# EAGLE design Pill Minder shield (EAGLE 6.5.0)
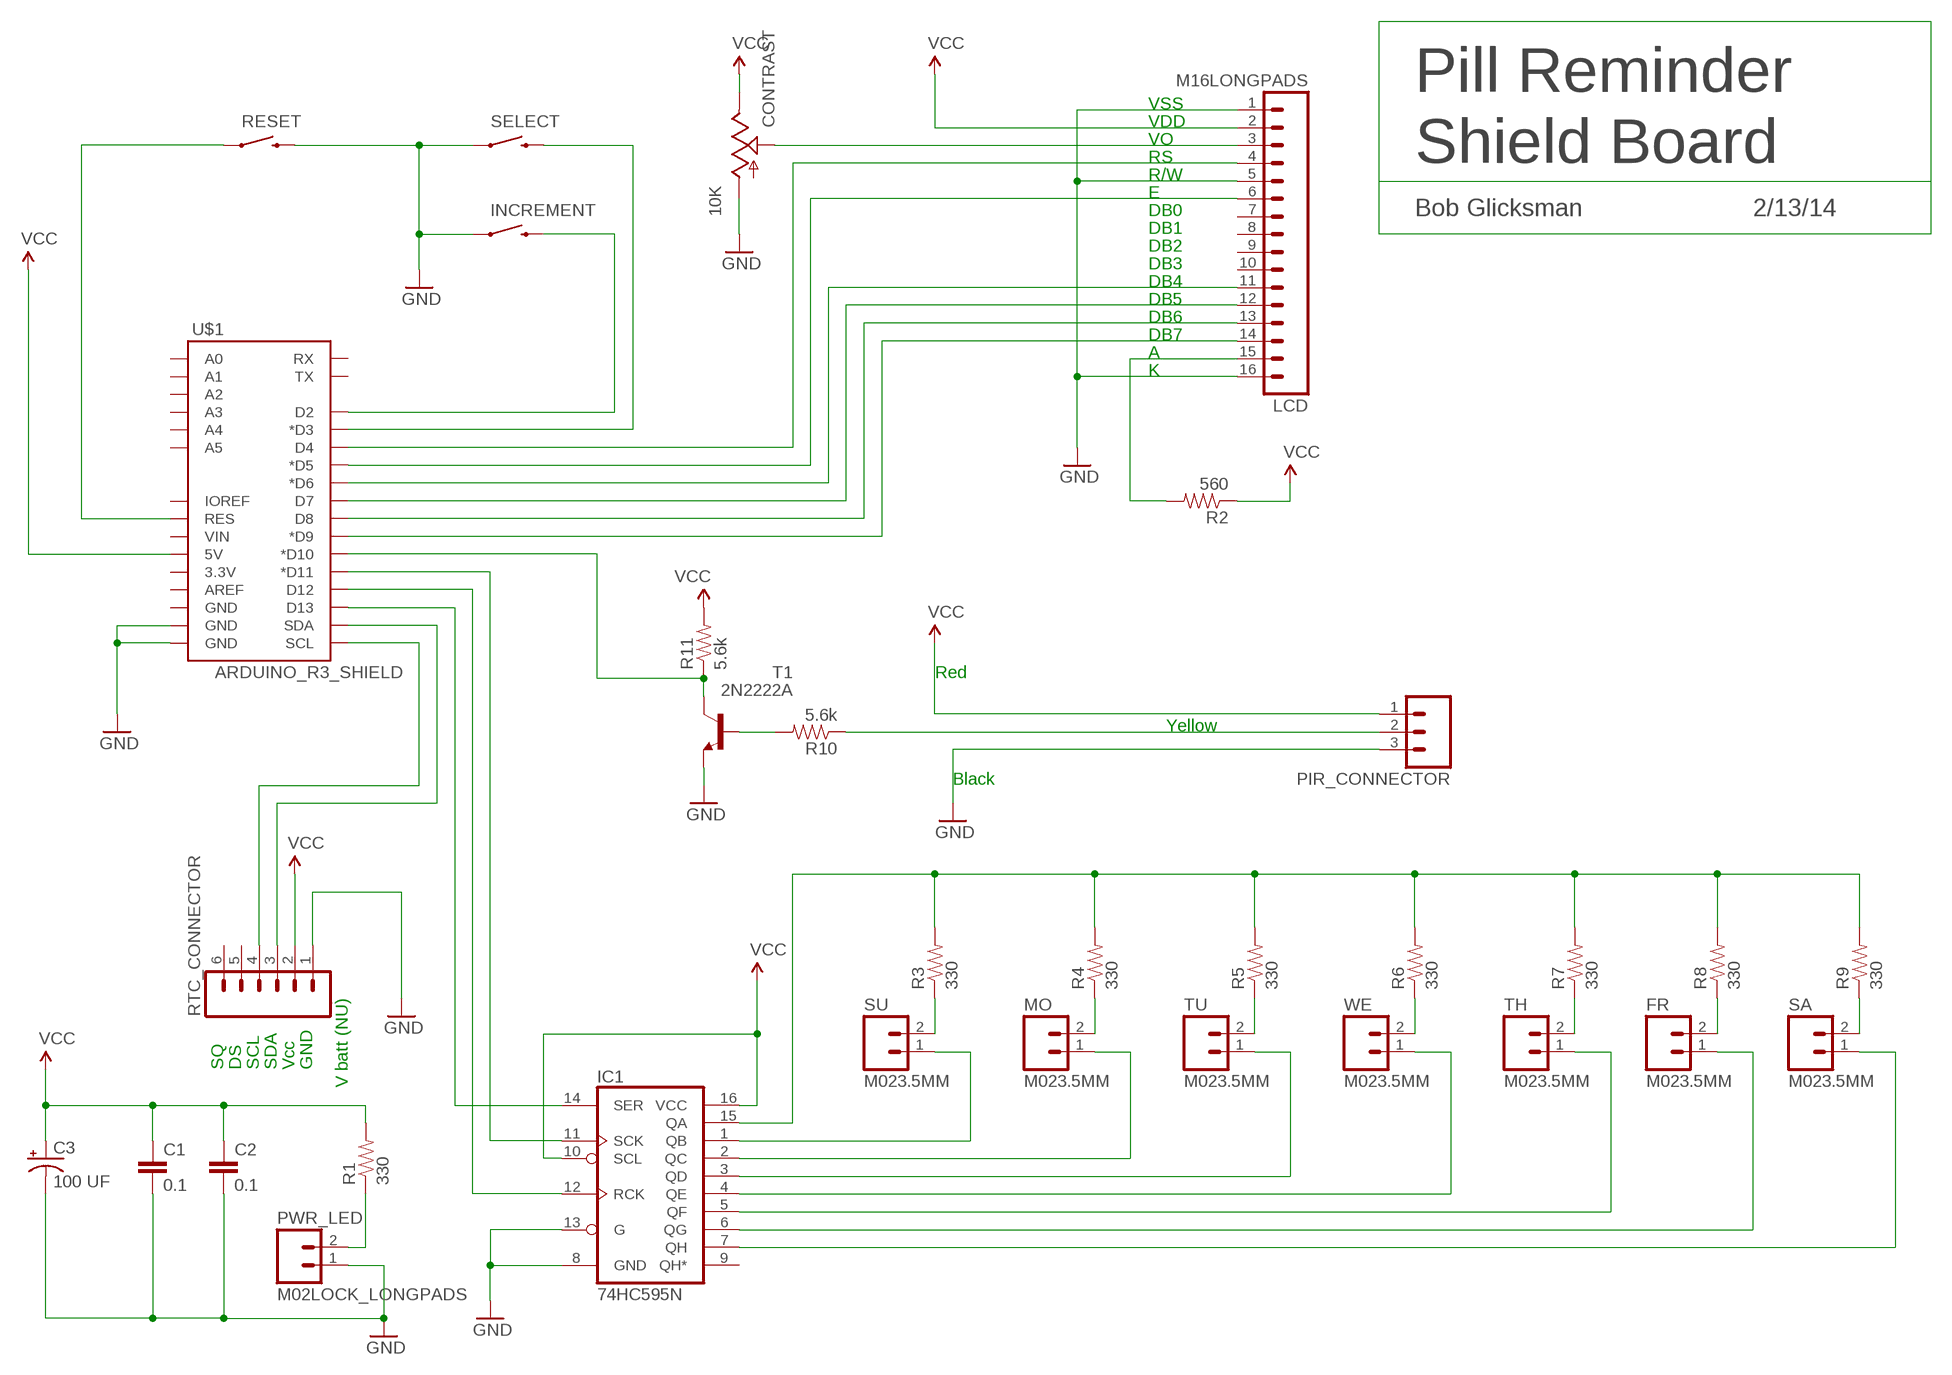
[diagram p0: schematic, sheet 1]

## Parts
C1  0.1  CAPPTH2  [CAP-PTH-SMALL2]
C2  0.1  CAPPTH2  [CAP-PTH-SMALL2]
C3  100 UF  CAP_POLPTH1  [CPOL-RADIAL-100UF-25V]
CONTRAST  10K  POTTRIM  [TRIM_POT]
FR  M023.5MM  [SCREWTERMINAL-3.5MM-2]
IC1  74HC595N  74LS595N  [DIL16]
INCREMENT  SWITCH-MOMENTARY-2PTH  [TACTILE-PTH]
LCD  M16LONGPADS  [1X16_LONGPADS]
MO  M023.5MM  [SCREWTERMINAL-3.5MM-2]
PIR_CONNECTOR  M03LONGPADS  [1X03_LONGPADS]
PWR_LED  M02LOCK_LONGPADS  [1X02_LOCK_LONGPADS]
R1  330  RESISTORPTH-1/4W  [AXIAL-0.4]
R2  560  RESISTORPTH-1/4W  [AXIAL-0.4]
R3  330  RESISTORPTH-1/4W  [AXIAL-0.4]
R4  330  RESISTORPTH-1/4W  [AXIAL-0.4]
R5  330  RESISTORPTH-1/4W  [AXIAL-0.4]
R6  330  RESISTORPTH-1/4W  [AXIAL-0.4]
R7  330  RESISTORPTH-1/4W  [AXIAL-0.4]
R8  330  RESISTORPTH-1/4W  [AXIAL-0.4]
R9  330  RESISTORPTH-1/4W  [AXIAL-0.4]
R10  5.6k  RESISTORPTH-1/4W  [AXIAL-0.4]
R11  5.6k  RESISTORPTH-1/4W  [AXIAL-0.4]
RESET  SWITCH-MOMENTARY-2PTH  [TACTILE-PTH]
RTC_CONNECTOR  M06LONGPADS  [1X06_LONGPADS]
SA  M023.5MM  [SCREWTERMINAL-3.5MM-2]
SELECT  SWITCH-MOMENTARY-2PTH  [TACTILE-PTH]
SU  M023.5MM  [SCREWTERMINAL-3.5MM-2]
T1  2N2222A  -NPN-TO92-EBC  [TO92-EBC]
TH  M023.5MM  [SCREWTERMINAL-3.5MM-2]
TU  M023.5MM  [SCREWTERMINAL-3.5MM-2]
U$1  ARDUINO_R3_SHIELD  [UNO_R3_SHIELD]
WE  M023.5MM  [SCREWTERMINAL-3.5MM-2]

## Nets
GND: C1.2 C2.2 C3.2(-) CONTRAST.3(A) IC1.8(GND) IC1.13(G) INCREMENT.1 LCD.1 LCD.5 LCD.16 PIR_CONNECTOR.3 PWR_LED.1 RESET.3 RTC_CONNECTOR.1 SELECT.1 T1.E U$1.GND@0(GND) U$1.GND@1(GND)
N$1: RESET.1 U$1.RES
N$2: IC1.7(QH) SA.1
N$3: IC1.1(QB) SU.1
N$4: R10.P$2 T1.B
N$5: IC1.2(QC) MO.1
N$6: IC1.3(QD) TU.1
N$7: IC1.4(QE) WE.1
N$8: IC1.5(QF) TH.1
N$9: FR.1 IC1.6(QG)
N$10: CONTRAST.1(S) LCD.3
N$11: SELECT.3 U$1.D3(*D3)
N$12: INCREMENT.3 U$1.D2
N$13: IC1.14(SER) U$1.D13
N$14: IC1.12(RCK) U$1.D12
N$15: IC1.11(SCK) U$1.D11(*D11)
N$16: RTC_CONNECTOR.4 U$1.SCL
N$17: RTC_CONNECTOR.3 U$1.SDA
N$18: LCD.4 U$1.D4
N$19: LCD.6 U$1.D5(*D5)
N$20: LCD.11 U$1.D6(*D6)
N$21: LCD.12 U$1.D7
N$22: LCD.13 U$1.D8
N$23: LCD.14 U$1.D9(*D9)
N$24: LCD.15 R2.P$2
N$26: R11.P$1 T1.C U$1.D10(*D10)
N$27: PWR_LED.2 R1.P$1
N$29: PIR_CONNECTOR.2 R10.P$1
N$30: R3.P$1 SU.2
N$31: MO.2 R4.P$1
N$32: R5.P$1 TU.2
N$33: R6.P$1 WE.2
N$34: R7.P$1 TH.2
N$35: IC1.15(QA) R3.P$2 R4.P$2 R5.P$2 R6.P$2 R7.P$2 R8.P$2 R9.P$2
N$36: R9.P$1 SA.2
N$37: FR.2 R8.P$1
VCC: C1.1 C2.1 C3.1(+) CONTRAST.2(E) IC1.10(SCL) IC1.16(VCC) LCD.2 PIR_CONNECTOR.1 R1.P$2 R2.P$1 R11.P$2 RTC_CONNECTOR.2 U$1.5V
Unconnected: IC1.9(QH*) LCD.7 LCD.8 LCD.9 LCD.10 RTC_CONNECTOR.5 RTC_CONNECTOR.6 U$1.3.3V U$1.A0 U$1.A1 U$1.A2 U$1.A3 U$1.A4 U$1.A5 U$1.AREF U$1.GND@2(GND) U$1.IOREF U$1.RX U$1.TX U$1.VIN

## Notes on the sheet
- Pill Reminder
- VSS
- VDD
- VO
- RS | Shield Board
- R/W
- E
- DB0 | Bob Glicksman | 2/13/14
- DB1
- DB2
- DB3
- DB4
- DB5
- DB6
- DB7
- A
- K
- Red
- Yellow
- Black
- SQ | DS | SCL | SDA | Vcc | GND
- V batt (NU)

## Library data of the parts
C1 C2 = SparkFun-Capacitors:CAP: Capacitor Standard 0603 ceramic capacitor, and 0.1" leaded capacitor.
C3 = SparkFun-Capacitors:CAP_POL: Capacitor Polarized These are standard SMD and PTH capacitors. Normally 10uF, 47uF, and 100uF in electrolytic and tantalum varieties. Always verify the external diameter of the through hole cap, it varies with capacity, voltage, and manufacturer. The EIA devices should be standard.
CONTRAST = SparkFun-Electromechanical:POT
FR MO PWR_LED SA SU TH TU WE = SparkFun-Connectors:M02: Standard 2-pin 0.1" header. Use with - straight break away headers ( PRT-00116) - right angle break away headers (PRT-00553) - swiss pins (PRT-00743) - machine pins (PRT-00117) - female headers (PRT-00115) Molex polarized connector foot print use with: PRT-08233 with associated crimp pins and housings. 2.54_SCREWTERM for use with PRT-10571. 3.5mm Screw Terminal footprints for PRT-08084 5mm Screw Terminal footprints for use with PRT-08433
IC1 = SparkFun-DigitalIC:74*595: 8-bit SHIFT REGISTER, output latch
INCREMENT RESET SELECT = SparkFun-Electromechanical:SWITCH-MOMENTARY-2: Various NO switches- pushbuttons, reed, etc
LCD = SparkFun-Connectors:M16: 1x16 .1" header
PIR_CONNECTOR = SparkFun-Connectors:M03: Header 3 Standard 3-pin 0.1" header. Use with straight break away headers (SKU : PRT-00116), right angle break away headers (PRT-00553), swiss pins (PRT-00743), machine pins (PRT-00117), and female headers (PRT-00115). Molex polarized connector foot print use with SKU : PRT-08232 with associated crimp pins and housings.
R1-R11 = SparkFun-Resistors:RESISTOR: Resistor Basic schematic elements and footprints for 0603, 1206, and PTH resistors.
RTC_CONNECTOR = SparkFun-Connectors:M06: Header 6 Standard 6-pin 0.1" header. Use with straight break away headers (SKU : PRT-00116), right angle break away headers (PRT-00553), swiss pins (PRT-00743), machine pins (PRT-00117), and female headers (PRT-00115). Molex polarized connector foot print use with SKU : PRT-08094 with associated crimp pins and housings. NOTES ON THE VARIANTS LOCK and LOCK_LONGPADS... This footprint was designed to help hold the alignment of a through-hole component (i.e. 6-pin header) while soldering it into place. You may notice that each hole has been shifted either up or down by 0.005 of an inch from it's more standard position (which is a perfectly straight line). This slight alteration caused the pins (the squares in the middle) to touch the edges of the holes. Because they are alternating, it causes a "brace" to hold the component in place. 0.005 has proven to be the perfect amount of "off-center" position when using our standard breakaway headers. Although looks a little odd when you look at the bare footprint, once you have a header in there, the alteration is very hard to notice. Also,if you push a header all the way into place, it is covered up entirely on the bottom side. This idea of altering the position of holes to aid alignment will be further integrated into the Sparkfun Library for other footprints. It can help hold any component with 3 or more connection pins.
T1 = transistor:*-NPN-: NPN Transistror BF959 corrected 2008.03.06
U$1 = SparkFun-Boards:ARDUINO_R3_SHIELD: Shield form compatible with the Arduino Uno R3.

## Board
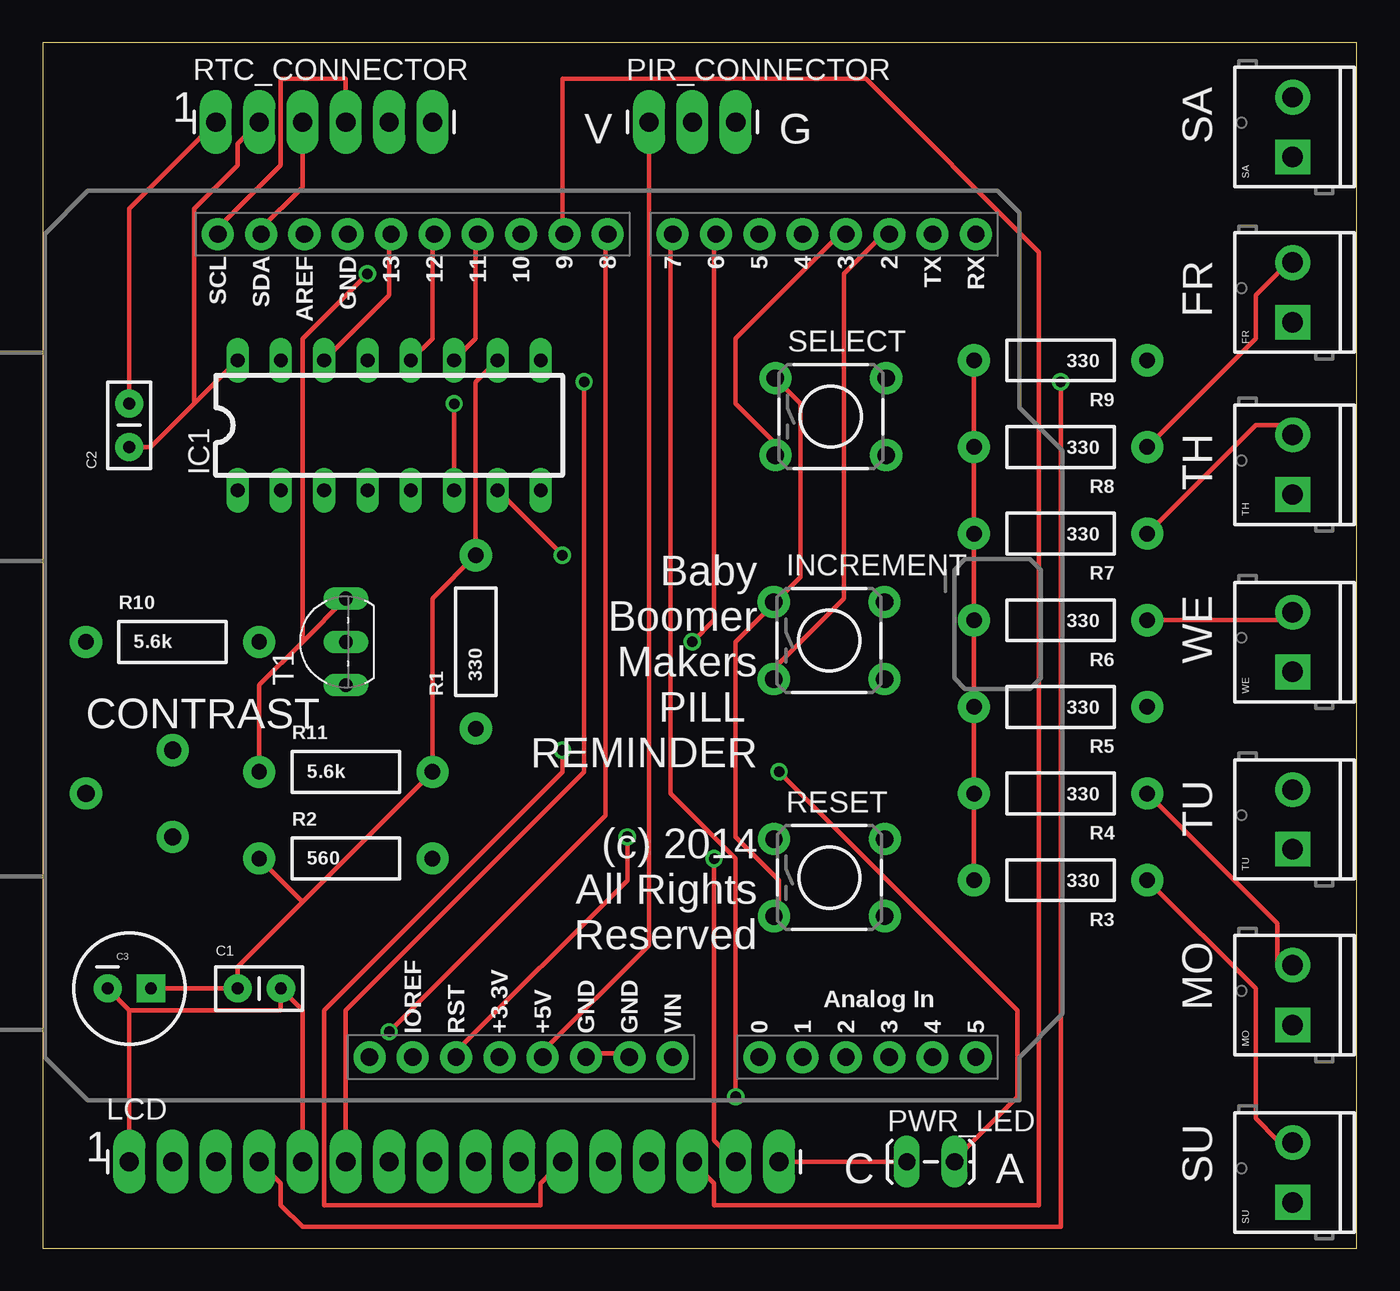
[diagram p1: board, top side]
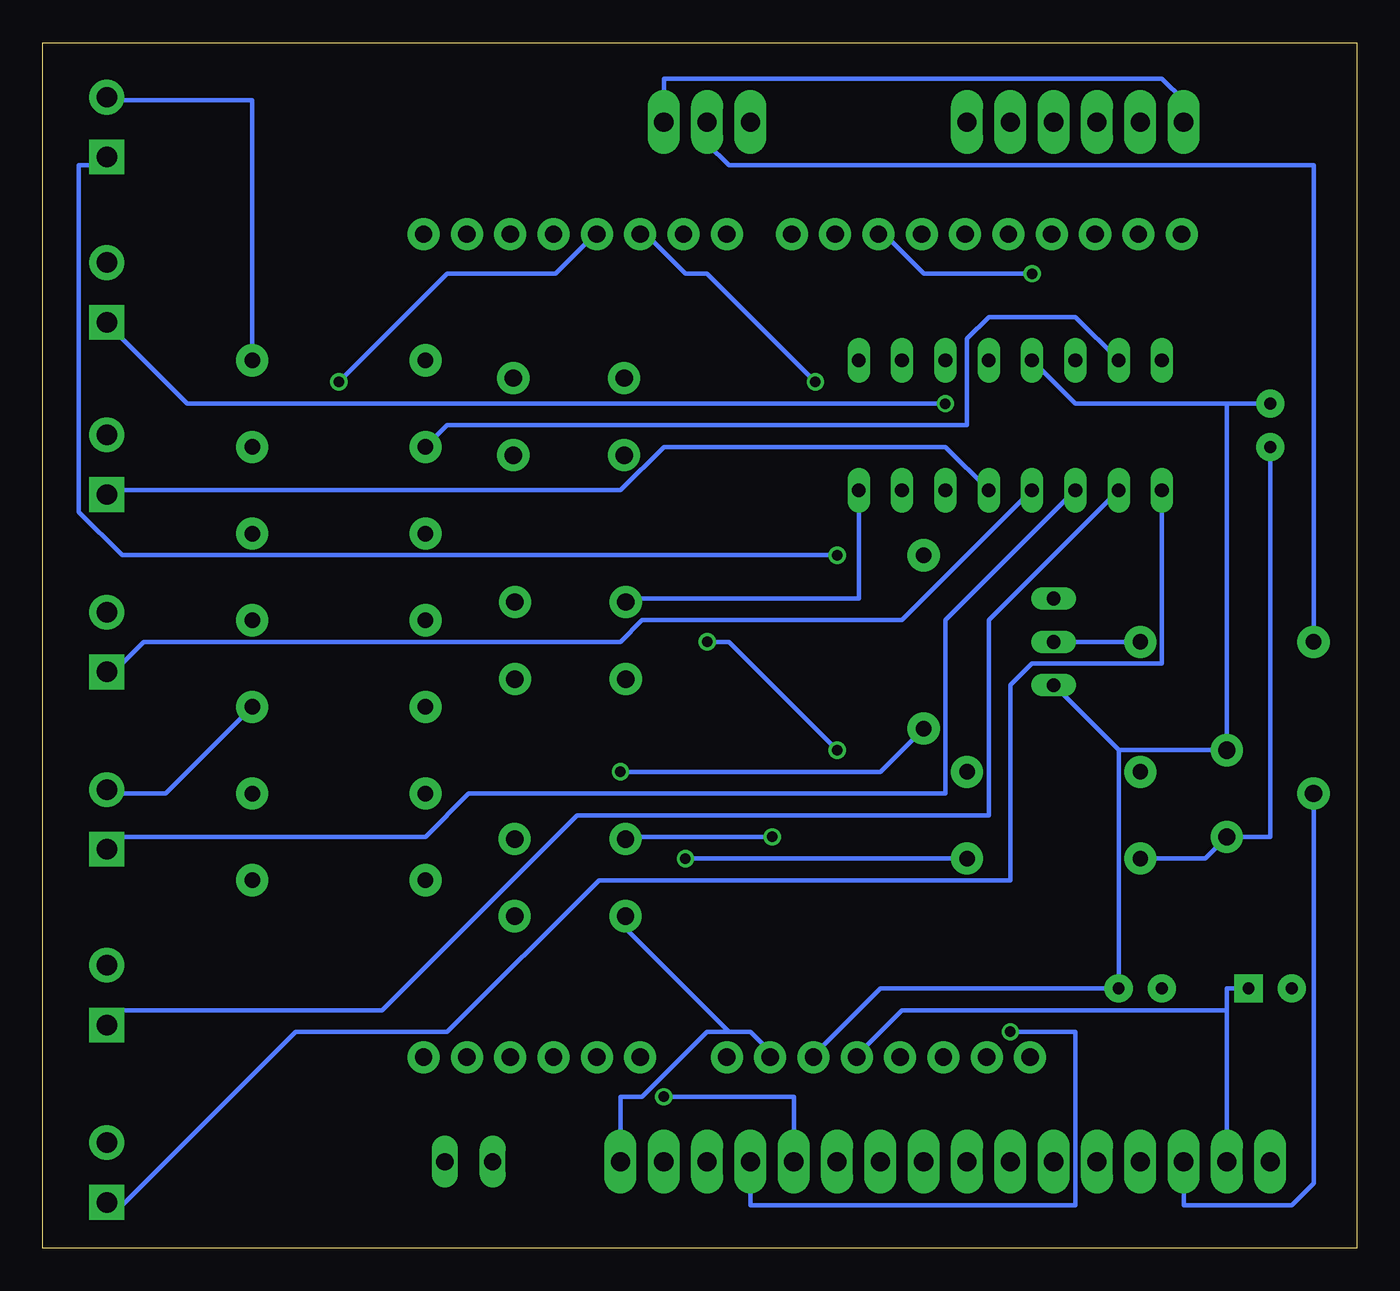
[diagram p2: board, bottom side, seen from below]

Size 77.06 x 70.7 mm. Coordinates in mm from the lower left corner, seen from the top.
Outline: 0,0 77.06,0 77.06,70.7 0,70.7 0,0
Copper layers (1*16): Top 0.035mm / dielectric 1.5mm / Bottom 0.035mm
Design rules "default": minimum track width 10mil, minimum drill 24mil, track to track 8mil, track to pad 8mil, pad to pad 8mil, via to via 8mil, smd to smd 8mil, copper to edge 40mil, drill to drill 8mil, minimum pad ring 10mil, minimum via ring 8mil, stop-mask expansion 4mil, vias tented up to drill 0mil, thermal gap 10mil

### Footprints (pad centres in the part's own frame; a part is rotated, then mirrored left to right if it is on the bottom)
CAP-PTH-SMALL2 = drill 0.7 pad 1.651: 1 0,0; 2 2.54,0
CPOL-RADIAL-100UF-25V = drill 0.7 pad 1.651 square: 1 1.27,0 | drill 0.7 pad 1.651: 2 -1.27,0
TRIM_POT = drill 1 pad 1.88: 1 5.08,0; 2 0,2.54; 3 0,-2.54
SCREWTERMINAL-3.5MM-2 = drill 1.2 pad 2.032 square: 1 0,0 | drill 1.2 pad 2.032: 2 3.5,0
DIL16 = drill 0.813 long: 1 -8.89,-3.81; 2 -6.35,-3.81; 3 -3.81,-3.81; 4 -1.27,-3.81; 5 1.27,-3.81; 6 3.81,-3.81; 7 6.35,-3.81; 8 8.89,-3.81; 9 8.89,3.81; 10 6.35,3.81; 11 3.81,3.81; 12 1.27,3.81; 13 -1.27,3.81; 14 -3.81,3.81; 15 -6.35,3.81; 16 -8.89,3.81
TACTILE-PTH = drill 1.016 pad 1.88: 1 -3.251,2.261; 2 3.251,2.261; 3 -3.251,-2.261; 4 3.251,-2.261
1X16_LONGPADS = drill 1.118 pad 1.88 long: 1 0,0; 2 2.54,0; 3 5.08,0; 4 7.62,0; 5 10.16,0; 6 12.7,0; 7 15.24,0; 8 17.78,0; 9 20.32,0; 10 22.86,0; 11 25.4,0; 12 27.94,0; 13 30.48,0; 14 33.02,0; 15 35.56,0; 16 38.1,0
1X03_LONGPADS = drill 1.118 pad 1.88 long: 1 0,0; 2 2.54,0; 3 5.08,0
1X02_LOCK_LONGPADS = drill 1.016 long: 1 -0.127,0; 2 2.667,0
AXIAL-0.4 = drill 0.9 pad 1.88: P$1 -5.08,0; P$2 5.08,0
1X06_LONGPADS = drill 1.118 pad 1.88 long: 1 0,0; 2 2.54,0; 3 5.08,0; 4 7.62,0; 5 10.16,0; 6 12.7,0
TO92-EBC = drill 0.813 long: B 0,-1.27; C 2.54,-1.27; E -2.54,-1.27
UNO_R3_SHIELD = drill 1.016 pad 1.88: 3.3V 50.8,26.67; 5V 50.8,29.21; A0 50.8,41.91; A1 50.8,44.45; A2 50.8,46.99; A3 50.8,49.53; A4 50.8,52.07; A5 50.8,54.61; AREF 2.54,15.24; D2 2.54,49.53; D3 2.54,46.99; D4 2.54,44.45; D5 2.54,41.91; D6 2.54,39.37; D7 2.54,36.83; D8 2.54,33.02; D9 2.54,30.48; D10 2.54,27.94; D11 2.54,25.4; D12 2.54,22.86; D13 2.54,20.32; GND@0 50.8,31.75; GND@1 50.8,34.29; GND@2 2.54,17.78; IOREF 50.8,21.59; NC 50.8,19.05; RES 50.8,24.13; RX 2.54,54.61; SCL 2.54,10.16; SDA 2.54,12.7; TX 2.54,52.07; VIN 50.8,36.83

### Placement (x,y rotation side)
C1  11.43,15.24 0 top
C2  5.08,46.99 90 top
C3  5.08,15.24 0 top
CONTRAST  7.62,26.67 180 top
FR  73.3,54.3 90 top
IC1  20.32,48.26 0 top
INCREMENT  46.12,35.64 0 top
LCD  5.08,5.08 0 top
MO  73.3,13.1 90 top
PIR_CONNECTOR  35.56,66.04 0 top
PWR_LED  50.8,5.08 0 top
R1  25.4,35.56 90 top
R2  17.78,22.86 0 top
R3  59.69,21.59 180 top
R4  59.69,26.67 180 top
R5  59.69,31.75 180 top
R6  59.69,36.83 180 top
R7  59.69,41.91 180 top
R8  59.69,46.99 180 top
R9  59.69,52.07 180 top
R10  7.62,35.56 0 top
R11  17.78,27.94 0 top
RESET  46.13,21.74 0 top
RTC_CONNECTOR  10.16,66.04 0 top
SA  73.3,64 90 top
SELECT  46.21,48.77 0 top
SU  73.3,2.7 90 top
T1  16.51,35.56 90 top
TH  73.3,44.2 90 top
TU  73.3,23.4 90 top
U$1  0.11,62.01 270 top
WE  73.3,33.8 90 top

### Tracks (layer width: path | path; a pad name or v marks a point on that pad's centre or on a via)
GND
  Top 0.254: 43.18,38.1 44.45,39.37 44.45,49.53 43.18,50.8 SELECT.1 | U$1.GND@0 31.75,11.43 34.29,11.43 U$1.GND@1 | 43.18,38.1 40.64,35.56 40.64,24.13 43.18,21.59 43.18,20.32 RESET.3 | 43.18,38.1 INCREMENT.1 | 5.08,13.97 C3.2 | LCD.1 5.08,13.97 | LCD.5 15.24,13.97 C1.2 13.97,13.97 5.08,13.97 | RTC_CONNECTOR.1 5.08,60.96 C2.2 | LCD.16 PWR_LED.1 50.8,5.08
  Bottom 0.254: IC1.8 29.21,38.1 43.18,38.1 INCREMENT.1 | 36.83,12.7 43.18,19.05 RESET.3 | 36.83,12.7 35.56,12.7 34.29,11.43 U$1.GND@1 | LCD.16 43.18,8.89 41.91,8.89 38.1,12.7 36.83,12.7 | 13.97,29.21 T1.E | 13.97,29.21 CONTRAST.3 7.62,49.53 | 13.97,29.21 C1.2 27.94,15.24 31.75,11.43 U$1.GND@0 | IC1.13 16.51,49.53 7.62,49.53 | C2.2 7.62,49.53 | PIR_CONNECTOR.3 40.64,68.58 11.43,68.58 10.16,67.31 RTC_CONNECTOR.1
N$1  (via drill 0.61)
  Top 0.254: v34.29,24.13 34.29,21.59 24.13,11.43 U$1.RES
  Bottom 0.254: v34.29,24.13 43.18,24.13 RESET.1
N$2  (via drill 0.61)
  Top 0.254: v30.48,40.64 IC1.7
  Bottom 0.254: v30.48,40.64 72.39,40.64 74.93,43.18 74.93,63.5 73.66,63.5 SA.1
N$3
  Bottom 0.254: IC1.1 11.43,34.29 19.05,34.29 20.32,33.02 20.32,21.59 44.45,21.59 53.34,12.7 62.23,12.7 72.39,2.54 SU.1
N$4
  Bottom 0.254: R10.P$2 T1.B
N$5
  Bottom 0.254: IC1.2 21.59,36.83 21.59,25.4 45.72,25.4 57.15,13.97 72.39,13.97 MO.1
N$6
  Bottom 0.254: IC1.3 24.13,36.83 24.13,26.67 52.07,26.67 54.61,24.13 72.39,24.13 TU.1
N$7
  Bottom 0.254: IC1.4 26.67,36.83 41.91,36.83 43.18,35.56 71.12,35.56 72.39,34.29 WE.1
N$8
  Bottom 0.254: IC1.5 24.13,46.99 40.64,46.99 43.18,44.45 72.39,44.45 TH.1
N$9  (via drill 0.61)
  Top 0.254: v24.13,49.53 IC1.6
  Bottom 0.254: v24.13,49.53 68.58,49.53 72.39,53.34 FR.1
N$10
  Bottom 0.254: LCD.3 10.16,2.54 3.81,2.54 2.54,3.81 CONTRAST.1
N$11
  Top 0.254: SELECT.3 43.18,46.99 40.64,49.53 40.64,53.34 46.99,59.69 U$1.D3
N$12
  Top 0.254: INCREMENT.3 43.18,34.29 46.99,38.1 46.99,57.15 49.53,59.69 U$1.D2
N$13
  Top 0.254: IC1.14 20.32,55.88 20.32,59.69 U$1.D13
N$14
  Top 0.254: IC1.12 22.86,53.34 22.86,59.69 U$1.D12
N$15
  Top 0.254: IC1.11 25.4,53.34 25.4,59.69 U$1.D11
N$16
  Top 0.254: RTC_CONNECTOR.4 17.78,68.58 13.97,68.58 13.97,63.5 10.16,59.69 U$1.SCL
N$17
  Top 0.254: RTC_CONNECTOR.3 15.24,62.23 12.7,59.69 U$1.SDA
N$18  (via drill 0.61)
  Top 0.254: LCD.4 13.97,3.81 13.97,2.54 15.24,1.27 59.69,1.27 v59.69,50.8
  Bottom 0.254: v59.69,50.8 53.34,57.15 46.99,57.15 44.45,59.69 U$1.D4
N$19  (via drill 0.61)
  Top 0.254: LCD.6 17.78,13.97 31.75,27.94 v31.75,50.8
  Bottom 0.254: v31.75,50.8 38.1,57.15 39.37,57.15 41.91,59.69 U$1.D5
N$20  (via drill 0.61)
  Top 0.254: LCD.11 29.21,3.81 29.21,2.54 16.51,2.54 16.51,13.97 30.48,27.94 v30.48,29.21 | v38.1,35.56 39.37,36.83 39.37,59.69 U$1.D6
  Bottom 0.254: v30.48,29.21 36.83,35.56 v38.1,35.56
N$21  (via drill 0.61)
  Top 0.254: v40.64,8.89 40.64,22.86 36.83,26.67 36.83,59.69 U$1.D7
  Bottom 0.254: LCD.12 33.02,8.89 v40.64,8.89
N$22  (via drill 0.61)
  Top 0.254: v20.32,12.7 33.02,25.4 33.02,59.69 U$1.D8
  Bottom 0.254: LCD.13 35.56,2.54 16.51,2.54 16.51,12.7 v20.32,12.7
N$23
  Top 0.254: LCD.14 39.37,3.81 39.37,2.54 58.42,2.54 58.42,58.42 48.26,68.58 30.48,68.58 30.48,59.69 U$1.D9
N$24  (via drill 0.61)
  Top 0.254: LCD.15 39.37,6.35 v39.37,22.86
  Bottom 0.254: R2.P$2 v39.37,22.86
N$26  (via drill 0.61)
  Top 0.254: 15.24,35.56 12.7,33.02 R11.P$1 | 15.24,35.56 T1.C | v19.05,57.15 15.24,53.34 15.24,35.56
  Bottom 0.254: v19.05,57.15 25.4,57.15 27.94,59.69 U$1.D10
N$27  (via drill 0.61)
  Top 0.254: v43.18,27.94 57.15,13.97 57.15,8.89 53.34,5.08 PWR_LED.2
  Bottom 0.254: R1.P$1 27.94,27.94 v43.18,27.94
N$29
  Bottom 0.254: R10.P$1 2.54,63.5 36.83,63.5 38.1,64.77 PIR_CONNECTOR.2
N$30
  Top 0.254: R3.P$1 71.12,15.24 71.12,7.62 72.39,6.35 SU.2
N$31
  Top 0.254: R4.P$1 72.39,19.05 72.39,16.51 MO.2
N$32
  Bottom 0.254: R5.P$1 69.85,26.67 72.39,26.67 TU.2
N$33
  Top 0.254: R6.P$1 72.39,36.83 WE.2
N$34
  Top 0.254: R7.P$1 71.12,48.26 73.66,48.26 TH.2
N$35
  Top 0.254: R3.P$2 R4.P$2 R5.P$2 R6.P$2 R7.P$2 R8.P$2 R9.P$2
  Bottom 0.254: IC1.15 16.51,54.61 21.59,54.61 22.86,53.34 22.86,48.26 53.34,48.26 R8.P$2
N$36
  Bottom 0.254: R9.P$1 64.77,67.31 72.39,67.31 SA.2
N$37
  Top 0.254: R8.P$1 71.12,53.34 71.12,55.88 73.66,58.42 FR.2
VCC
  Top 0.254: 8.89,49.53 6.35,46.99 C2.1 | 8.89,49.53 IC1.16 | RTC_CONNECTOR.2 11.43,64.77 11.43,63.5 8.89,60.96 8.89,49.53 | IC1.10 25.4,50.8 R1.P$2 22.86,38.1 R11.P$2 15.24,20.32 | C3.1 C1.1 11.43,16.51 15.24,20.32 | PIR_CONNECTOR.1 35.56,17.78 29.21,11.43 U$1.5V | 15.24,20.32 R2.P$1
  Bottom 0.254: R2.P$1 8.89,22.86 CONTRAST.2 5.08,24.13 C2.1 | 7.62,13.97 7.62,15.24 C3.1 | 7.62,13.97 LCD.2 | 7.62,13.97 26.67,13.97 29.21,11.43 U$1.5V

### Text on the board
tPlace: 1 | V | G | SA | FR | TH | Baby / Boomer / Makers / PILL / REMINDER / / (c) 2014 / All Rights / Reserved | WE | CONTRAST | TU | MO | 1 | C | A | SU